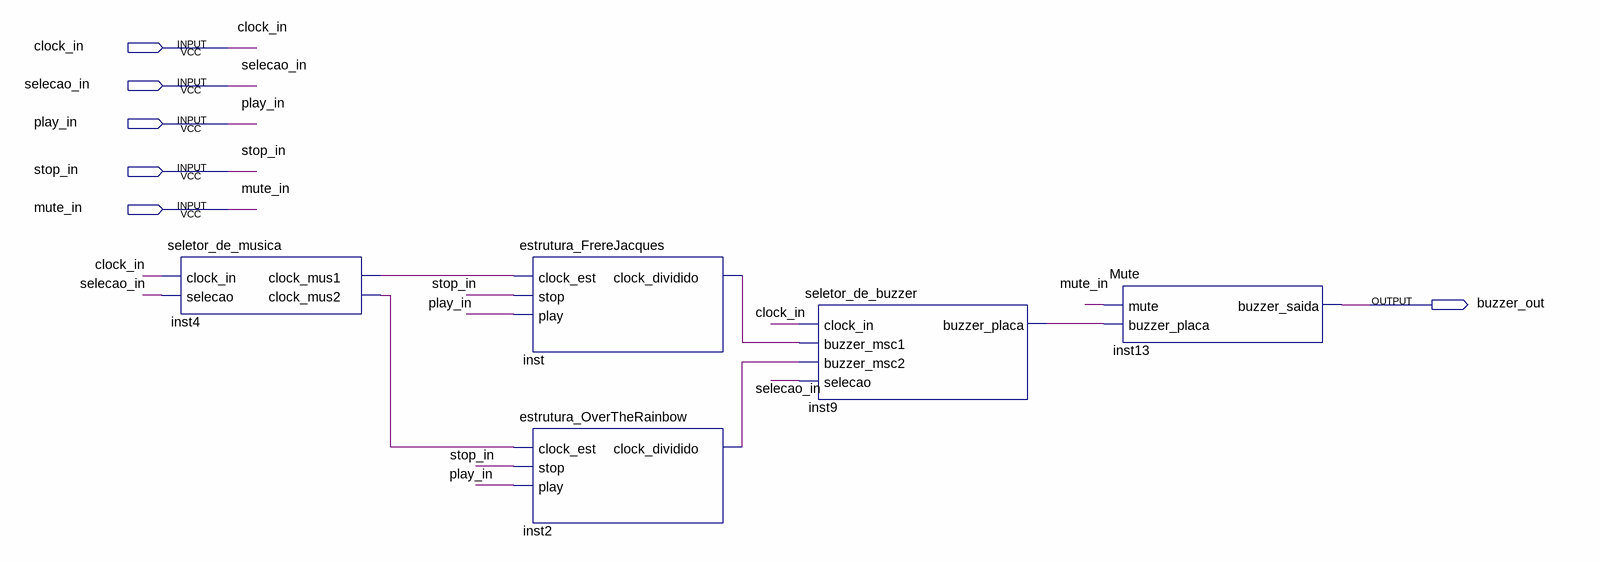
[diagram p0: schematic sheet]
// Quartus schematic bloco_musicas_e_mute.bdf as structural Verilog: 5 symbols, 6 pins
module bloco_musicas_e_mute (
  input  clock_in,
  input  selecao_in,
  input  play_in,
  input  stop_in,
  input  mute_in,
  output buzzer_out
);

  wire inst2_clock_dividido, inst4_clock_mus1, inst4_clock_mus2, inst9_buzzer_placa, inst_clock_dividido;

  seletor_de_musica inst4 (
    .clock_in(clock_in), .selecao(selecao_in), .clock_mus1(inst4_clock_mus1), .clock_mus2(inst4_clock_mus2));
  estrutura_FrereJacques inst (
    .clock_est(inst4_clock_mus1), .stop(stop_in), .play(play_in), .clock_dividido(inst_clock_dividido));
  estrutura_OverTheRainbow inst2 (
    .clock_est(inst4_clock_mus2), .stop(stop_in), .play(play_in), .clock_dividido(inst2_clock_dividido));
  seletor_de_buzzer inst9 (
    .clock_in(clock_in), .buzzer_msc1(inst_clock_dividido), .buzzer_msc2(inst2_clock_dividido),
    .selecao(selecao_in), .buzzer_placa(inst9_buzzer_placa));
  Mute inst13 (.mute(mute_in), .buzzer_placa(inst9_buzzer_placa), .buzzer_saida(buzzer_out));
endmodule
